# Altium schematic sheet Power Management.SchDoc
size A3; DrawnBy: UGUR KELES; SheetNumber: 2; SheetTotal: 3; Size: A3
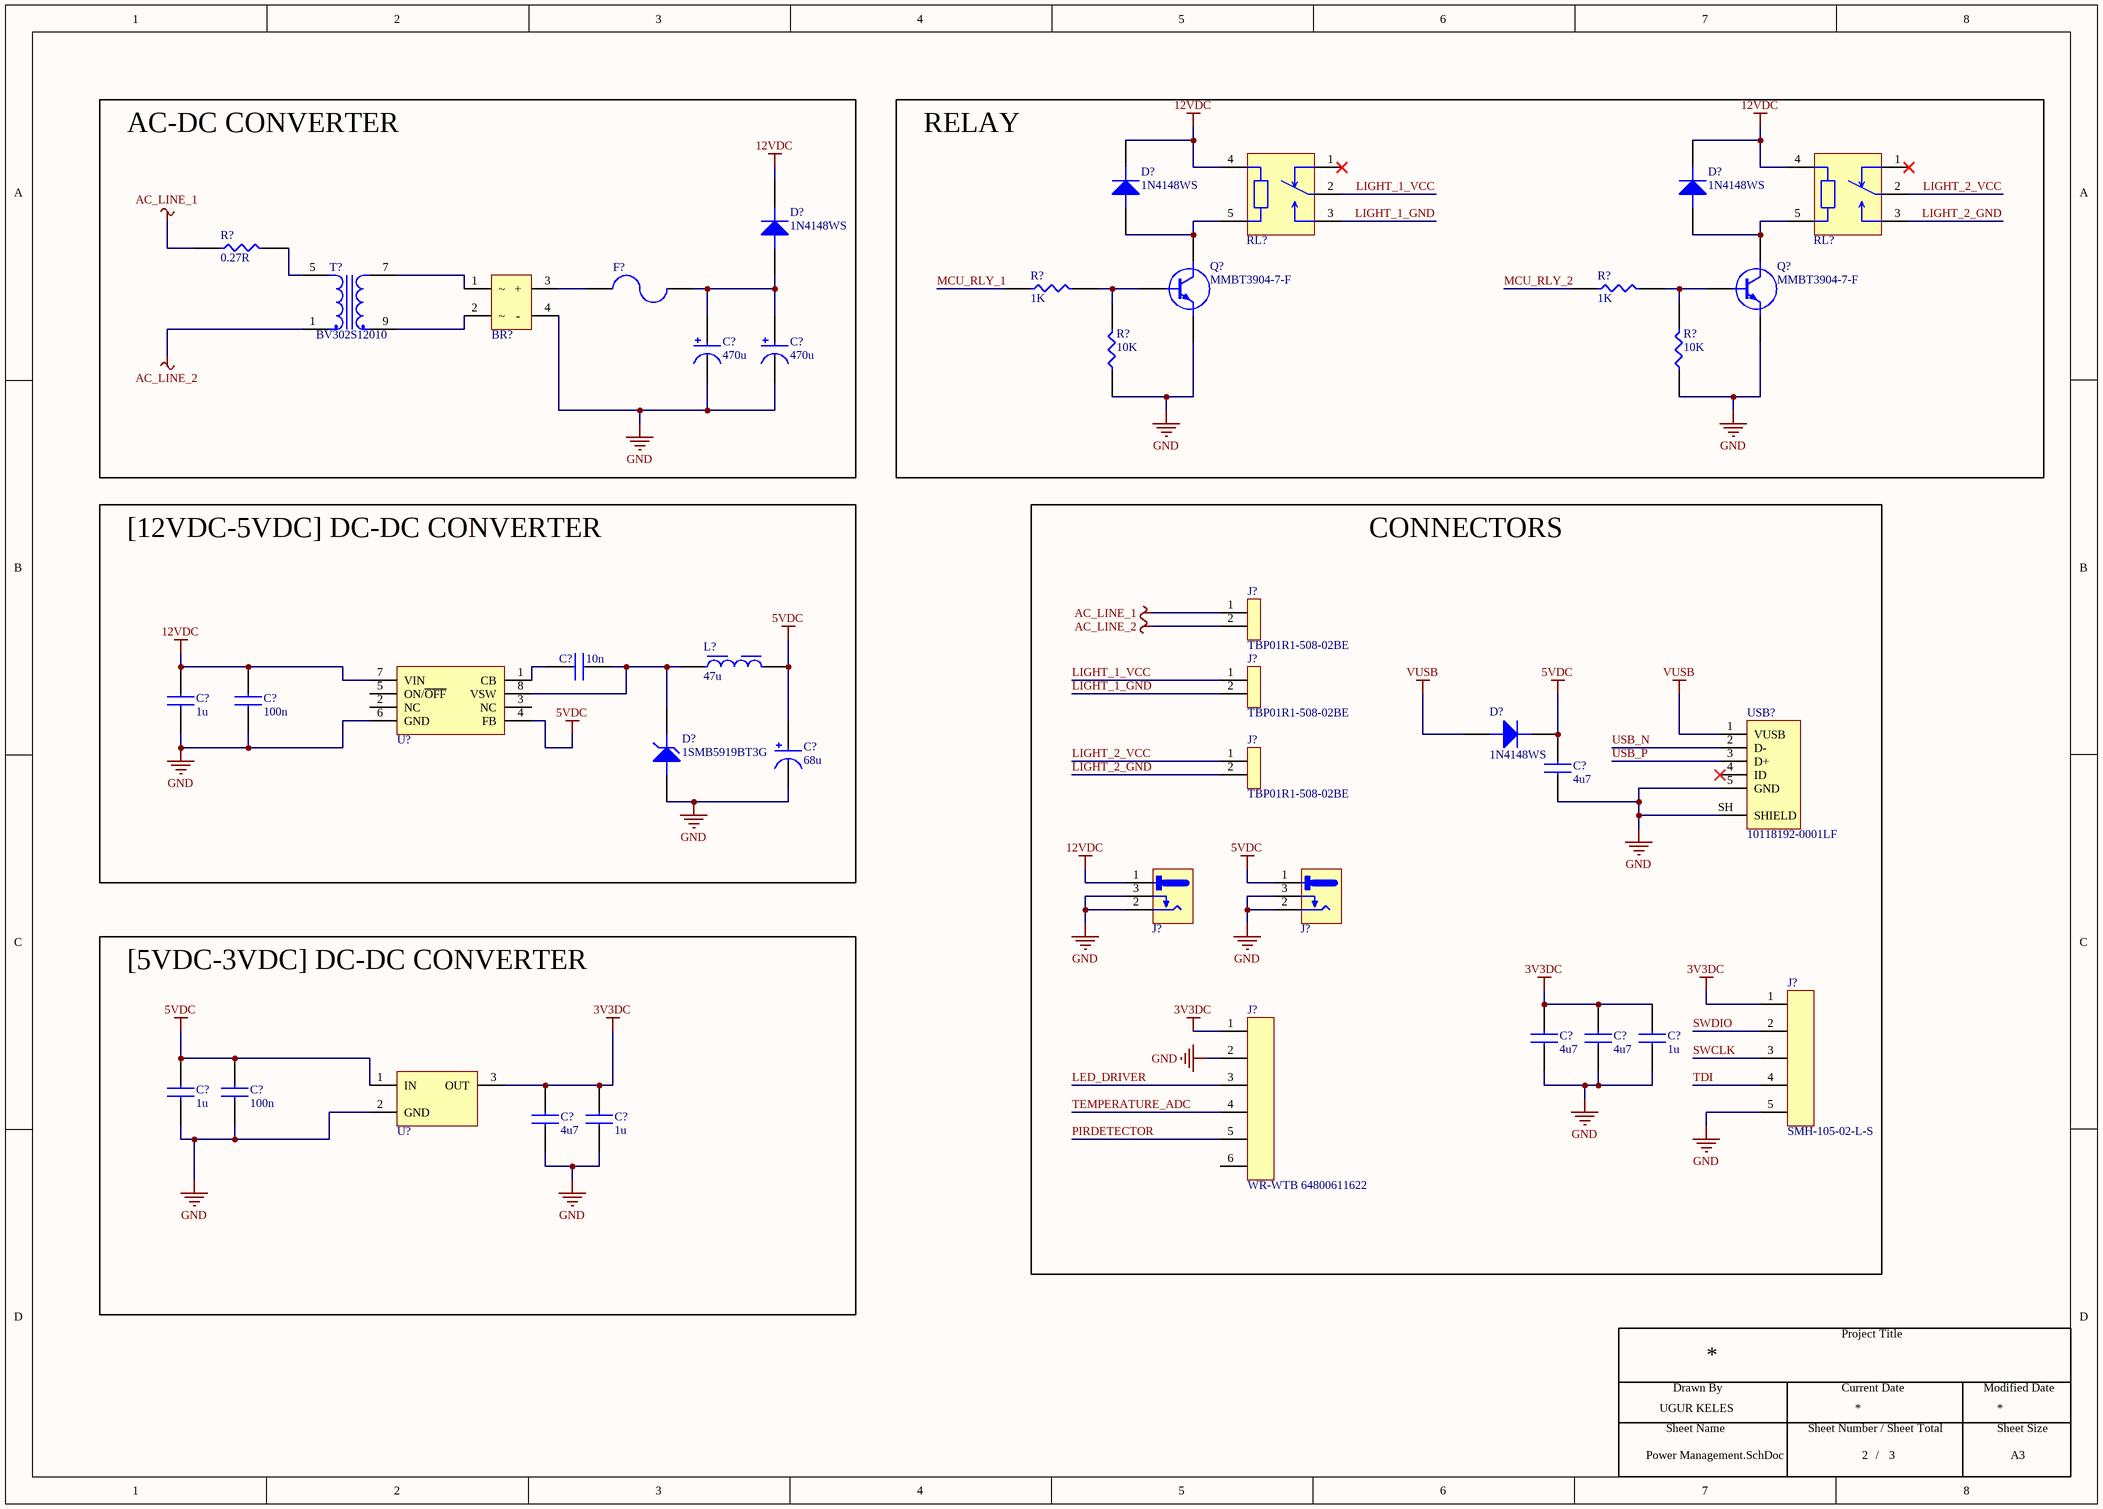
[diagram p0: Power Management.SchDoc]

## Parts
(Parts that share a designator on the sheet are numbered #1, #2 ... from top to bottom, then left to right.)
BR?  DB105S  [DB105S]  (value not drawn)
C?#1  470u  [CAP ALUM RADIAL TH D10 L20 P5]
C?#2  470u  [CAP ALUM RADIAL TH D10 L20 P5]
C?#3  10n  [CAPACITOR 0603]
C?#4  1u  [CAPACITOR 0805 - duplicate]
C?#5  100n  [CAPACITOR 0805 - duplicate]
C?#6  68u  [CAP ALUM RADIAL SMD D6.3 L7.7 P1.8]
C?#7  4u7  [CAPACITOR 0805 - duplicate]
C?#8  4u7  [CAPACITOR 0805 - duplicate]
C?#9  4u7  [CAPACITOR 0805 - duplicate]
C?#10  1u  [CAPACITOR 0805 - duplicate]
C?#11  1u  [CAPACITOR 0805 - duplicate]
C?#12  100n  [Capacitor 0603]
C?#13  4u7  [CAPACITOR 0805 - duplicate]
C?#14  1u  [CAPACITOR 0805 - duplicate]
D?#1  1N4148WS  [SOD-323F]
D?#2  1N4148WS  [SOD-323F]
D?#3  1N4148WS  [SOD-323F]
D?#4  1N4148WS  [SOD-323F]
D?#5  1SMB5919BT3G  [SMB]
F?  3413.0216.22  [3413.0216.22]  (value not drawn)
J?#1  TBP01R1-508-02BE  [2P TH TERMINAL 5.08 MALE]
J?#2  TBP01R1-508-02BE  [2P TH TERMINAL 5.08 MALE]
J?#3  TBP01R1-508-02BE  [2P TH TERMINAL 5.08 MALE]
J?#4  PJ-037AH-SMT-TR  [JACK]  (value not drawn)
J?#5  PJ-037AH-SMT-TR  [JACK]  (value not drawn)
J?#6  SMH-105-02-L-S  [5P TH CONN 2.54 FEMALE HEADER]
J?#7  WR-WTB 64800611622  [6P SMD TERMINAL 1.50 MALE]
L?  47u  [IND 1212]
Q?#1  MMBT3904-7-F  [SOT-23F]
Q?#2  MMBT3904-7-F  [SOT-23F]
R?#1  0.27R  [RES 5WD27 AXIAL]
R?#2  1K  [Resistor 0603]
R?#3  1K  [Resistor 0603]
R?#4  10K  [Resistor 0603]
R?#5  10K  [Resistor 0603]
RL?#1  ALQ112  [ALQ112]  (value not drawn)
RL?#2  ALQ112  [ALQ112]  (value not drawn)
T?  BV302S12010  [BV302S12010]
U?#1  LM2675MX-12/NOPB  [SOIC-8]  (value not drawn)
U?#2  AP7361-33E-13  [SOT223/SOT223R]  (value not drawn)
USB?  10118192-0001LF  [USB2.0 MICRO B SMD]

## Blocks framed on the sheet
AC-DC CONVERTER: BR? C?#1 C?#2 D?#3 F? R?#1 T?
RELAY: D?#1 D?#2 Q?#1 Q?#2 R?#2-R?#5 RL?#1 RL?#2
[12VDC-5VDC] DC-DC CONVERTER: C?#3-C?#6 D?#5 L? U?#1
CONNECTORS: C?#7-C?#10 D?#4 J?#1-J?#7 USB?
[5VDC-3VDC] DC-DC CONVERTER: C?#11-C?#14 U?#2

## Nets
3V3DC: C?#8.2 C?#9.2 C?#10.2 C?#13.2 C?#14.2 J?#6.1 J?#7.1 U?#2.3(OUT)
5VDC: C?#6.1 C?#7.2 C?#11.2 C?#12.2 D?#4.2(C) J?#5.1(VCC) L?.2 U?#1.4(FB) U?#2.1(IN)
12VDC: C?#4.2 C?#5.2 D?#1.2(C) D?#2.2(C) D?#3.2(C) J?#4.1(VCC) RL?#1.4 RL?#2.4 U?#1.7(VIN)
AC_LINE_1: J?#1.1 R?#1.1
AC_LINE_2: J?#1.2 T?.1
GND: BR?.4(-) C?#1.2 C?#2.2 C?#4.1 C?#5.1 C?#6.2 C?#7.1 C?#8.1 C?#9.1 C?#10.1 C?#11.1 C?#12.1 C?#13.1 C?#14.1 D?#5.1(A) J?#4.2(GND) J?#4.3(SH) J?#5.2(GND) J?#5.3(SH) J?#6.5 J?#7.2 Q?#1.2(E) Q?#2.2(E) R?#4.1 R?#5.1 U?#1.6(GND) U?#2.2(GND) USB?.5(GND) USB?.SH(SHIELD)
VUSB: D?#4.1(A) USB?.1(VUSB)
LED_DRIVER: J?#7.3
LIGHT_1_GND: J?#2.2 RL?#1.3
LIGHT_1_VCC: J?#2.1 RL?#1.2
LIGHT_2_GND: J?#3.2 RL?#2.3
LIGHT_2_VCC: J?#3.1 RL?#2.2
MCU_RLY_1: R?#2.1
MCU_RLY_2: R?#3.1
PIRDETECTOR: J?#7.5
SWCLK: J?#6.3
SWDIO: J?#6.2
TDI: J?#6.4
TEMPERATURE_ADC: J?#7.4
USB_N: USB?.2(D-)
USB_P: USB?.3(D+)
NetBR?_1: BR?.1 T?.7
NetBR?_2: BR?.2 T?.9
NetBR?_3: BR?.3(+) F?.1
NetC?#1_1: C?#1.1 C?#2.1 D?#3.1(A) F?.2
NetC?#3_1: C?#3.1 U?#1.1(CB)
NetC?#3_2: C?#3.2 D?#5.2(C) L?.1 U?#1.8(VSW)
NetD?#1_1: D?#1.1(A) Q?#1.3(C) RL?#1.5
NetD?#2_1: D?#2.1(A) Q?#2.3(C) RL?#2.5
NetQ?#1_1: Q?#1.1(B) R?#2.2 R?#4.2
NetQ?#2_1: Q?#2.1(B) R?#3.2 R?#5.2
NetR?#1_2: R?#1.2 T?.5

Not connected (* = marked no-connect by the designer): J?#7 6; RL?#1 1*; RL?#2 1*; U?#1 2(NC) 3(NC) 5(ON/~{OFF}); USB? 4(ID)*

## Notes on the sheet
- Drawn By
- Project Title
- Current Date
- Modified Date
- Sheet Name
- Sheet Number / Sheet Total
- /
- Sheet Size

## Library data of the parts
BR? = DB105S: Bridge Rectifier Single Phase Standard 600 V Surface Mount DB-S; Manufacturer: Sangdest Microelectronics; Designed by: UK; Supplier: Digikey; Supplier Part Number: 1655-DB105SCT-ND; Manufacturer Part Number: DB105S; RoHS: No; Category: Uncategorized; Stock: 12377; Pricing: 1=0.41, 10=0.29, 100=0.1464, 500=0.12978 (USD)
C?#1 C?#2 = CAP ALUM 470uF RADIAL TH: Radial Electrolytic Aluminium Capacitor, 470uF, 50VDC, 20%; Manufacturer: KEMET; Manufacturer Part Number: ESH477M050AH4AA; Designed by: UK; Voltage Rating (DC): 50V; Supplier: Digikey; Supplier Part Number: 399-15683-ND; RoHS: Yes; Category: LDO; Stock: 10333; Pricing: 1=0.64, 10=0.432, 200=0.28415, 1000=0.1887, 5000=0.1665, 10000=0.1554 (USD); Diameter: 10mm; Height: 20mm; ComponentLink1URL: https://api.kemet.com/component-edge/download/datasheet/ESH477M050AH4AA.pdf?src-supplier=Digikey; ComponentLink1Description: https://api.kemet.com/component-edge/download/datasheet/ESH477M050AH4AA.pdf?src-supplier=Digikey; ComponentLink2URL: https://datasheet.octopart.com/ESH477M050AH4AA-KEMET-datasheet-130075338.pdf?src-supplier=Newark; ComponentLink2Description: https://datasheet.octopart.com/ESH477M050AH4AA-KEMET-datasheet-130075338.pdf?src-supplier=Newark
C?#3 = CAP CER 10nF 0603: 0603 16V X7R 10nF 10% multilayer ceramic capacitor; Manufacturer: Walsin Technologies; Manufacturer Part Number: 0603B103K160CT; Designed by: UK; Supplier: Digikey; Supplier Part Number: 1292-1384-6-ND; RoHS: Yes; Category: Ceramic Capacitors; Stock: 66398; Pricing: 1=0.1, 10=0.031, 50=0.018, 100=0.0139, 500=0.0105, 1000=0.00825 (USD); Lead Free: 5697LeadFree; ComponentLink1URL: http://www.farnell.com/datasheets/1958513.pdf?src-supplier=Farnell; ComponentLink1Description: http://www.farnell.com/datasheets/1958513.pdf?src-supplier=Farnell; ComponentLink2URL: https://datasheet.octopart.com/0603B103K160CT-Walsin-Technologies-datasheet-136037192.pdf?src-supplier=Future+Electronics; ComponentLink2Description: https://datasheet.octopart.com/0603B103K160CT-Walsin-Technologies-datasheet-136037192.pdf?src-supplier=Future+Electronics; ComponentLink3URL: http://www.passivecomponent.com/wp-content/uploads/2018/10/MLCC.pdf?src-supplier=Digikey; ComponentLink3Description: http://www.passivecomponent.com/wp-content/uploads/2018/10/MLCC.pdf?src-supplier=Digikey; ComponentLink4URL: https://datasheet.octopart.com/0603B103K160CT-Walsin-Technologies-datasheet-85392065.pdf?src-supplier=Element14; ComponentLink4Description: https://datasheet.octopart.com/0603B103K160CT-Walsin-Technologies-datasheet-85392065.pdf?src-supplier=Element14; ComponentLink5URL: https://datasheet.octopart.com/0603B103K160CT-Walsin-Technologies-datasheet-62066062.pdf?src-supplier=TME; ComponentLink5Description: https://datasheet.octopart.com/0603B103K160CT-Walsin-Technologies-datasheet-62066062.pdf?src-supplier=TME
C?#4 C?#10 C?#11 C?#14 = CAP CER 1uF 0805: Multilayer Ceramic Capacitor, 1 uF, 50 V, ± 10%, X7R, 0805 [2012 Metric]; Manufacturer: Samsung; Manufacturer Part Number: CL21B105KBFNNNE; Designed by: UK; Voltage Rating (DC): 50V; Value: 1uF; Supplier: Digikey; Supplier Part Number: 1276-1029-2-ND; RoHS: Yes; Category: Ceramic Capacitors; Stock: 1265790; Pricing: 2000=0.02015, 4000=0.01844, 10000=0.01715, 14000=0.01629, 50000=0.01415, 100000=0.01169, 200000=0.0114 (USD); Mounting Technology: Surface Mount; Case/Package: 0805; Material: Ceramic; Case Code (Metric): 2012; Case Code (Imperial): 0805; Min Operating Temperature: -55°C; Max Operating Temperature: 125°C; Tolerance: 10%; Packaging: Tape and Reel; Package Quantity: 1; Voltage Rating: 50V; Dielectric: X7R; Voltage: 50V; Series: CL; Construction: Flat; Length: 2mm; Width: 0.049inch; Height: 1.25mm; Thickness: 0.053inch; Depth: 1.25mm; Radiation Hardening: No; RoHS Compliant: Yes; ComponentLink1URL: https://datasheet.ciiva.com/25800/cl21b105kbfnnne-25800291.pdf?src-supplier=Digikey; ComponentLink1Description: https://datasheet.ciiva.com/25800/cl21b105kbfnnne-25800291.pdf?src-supplier=Digikey
C?#5 = CAP CER 100nF 0805: Multilayer Ceramic Capacitor, 0.1 uF, 50 V, ± 10%, X7R, 0805 [2012 Metric]; Manufacturer: Samsung; Manufacturer Part Number: CL21B104KBCNNNC; Value: 100nF; Voltage Rating: 50V; Designed by: UK; Supplier: Digikey; Supplier Part Number: 1276-1003-6-ND; RoHS: Yes; Category: Ceramic Capacitors; Stock: 1751530; Pricing: 1=0.1, 10=0.042, 50=0.024, 100=0.0186, 500=0.01404, 1000=0.01103 (USD); Mounting Technology: Surface Mount; Case/Package: 0805; Case Code (Metric): 2012; Case Code (Imperial): 0805; Material: Ceramic; Min Operating Temperature: -55°C; Max Operating Temperature: 125°C; Tolerance: 10%; Dielectric: X7R; Packaging: Tape and Reel; Voltage: 50V; Series: CL; Construction: Flat; Voltage Rating (DC): 50V; Length: 2mm; Width: 0.049inch; Height: 0.85mm; Depth: 1.25mm; Thickness: 0.037inch; Radiation Hardening: No; RoHS Compliant: Yes; Lead Free: 5697LeadFree; ComponentLink1URL: https://datasheet.ciiva.com/25710/cl21b104kbcnnnc-25710182.pdf?src-supplier=Digikey; ComponentLink1Description: https://datasheet.ciiva.com/25710/cl21b104kbcnnnc-25710182.pdf?src-supplier=Digikey; ComponentLink2URL: https://datasheet.ciiva.com/29199/454152-da-01-en-vs-kondensator-0805-29199814.pdf?src-supplier=Conrad; ComponentLink2Description: https://datasheet.ciiva.com/29199/454152-da-01-en-vs-kondensator-0805-29199814.pdf?src-supplier=Conrad
C?#6 = CAP ALUM 68UF RADIAL SMD: Cap Aluminum Lytic 68uF 35V 20%( 6.3 X 7.7mm) SMD 0.34 Ohm 280mA 2000h 105C T/R; Manufacturer: KEMET; Manufacturer Part Number: EEV686M035A9HAA; Designed by: UK; Supplier: Mouser; Supplier Part Number: 80-EEV686M035A9HAA; RoHS: Yes; Category: Aluminum Electrolytic Capacitors; Stock: 13222; Pricing: 1=0.39, 10=0.221, 50=0.221, 100=0.143, 1000=0.125, 10000=0.125 (USD); ComponentLink1URL: https://datasheet.ciiva.com/5365/kem-a4002-eev-535332-5365784.pdf?src-supplier=Mouser; ComponentLink1Description: https://datasheet.ciiva.com/5365/kem-a4002-eev-535332-5365784.pdf?src-supplier=Mouser
C?#7-C?#9 C?#13 = CAP CER 4.7uF 0805: Multilayer Ceramic Capacitor, 4.7 uF, 25 V, ± 10%, X5R, 0805 [2012 Metric]; Manufacturer: Samsung; Manufacturer Part Number: CL21A475KAQNNNE; Designed by: UK; Value: 4.7uF; Voltage Rating: 25V; Supplier: Digikey; Supplier Part Number: 1276-1244-2-ND; RoHS: Yes; Category: Ceramic Capacitors; Stock: 3213374; Pricing: 2000=0.01305, 4000=0.01194, 10000=0.0111, 14000=0.01055, 50000=0.00978 (USD); Mounting Technology: Surface Mount; Case/Package: 0805; Case Code (Metric): 2012; Case Code (Imperial): 0805; Material: Ceramic; Min Operating Temperature: -55°C; Max Operating Temperature: 85°C; Packaging: Tape and Reel; Tolerance: 10%; Dielectric: X5R; Voltage Rating (DC): 25V; Series: CL; Construction: Flat; Length: 2mm; Height: 1.25mm; Depth: 1.25mm; Radiation Hardening: No; Lead Free: Lead Free; RoHS Compliant: Yes; ComponentLink1URL: https://datasheet.ciiva.com/25798/cl21a475kaqnnne-25798882.pdf?src-supplier=Digikey; ComponentLink1Description: https://datasheet.ciiva.com/25798/cl21a475kaqnnne-25798882.pdf?src-supplier=Digikey
C?#12 = CAP CER 100nF 0603: Multilayer Ceramic Capacitor, 0.1 uF, 50 V, ± 10%, X7R, 0603 [1608 Metric]; Manufacturer: KEMET; Manufacturer Part Number: C0603C104K5RACTU; Material: 4241ConductorMaterial; Value: 100nF; Voltage Rating: 50V; Temperature Coefficient: 30ppm/°C; Designed by: UK; Supplier: Digikey; Supplier Part Number: 399-C0603C104K5RAC7867TR-ND; RoHS: Yes; Category: Ceramic Capacitors; Stock: 3063153; Pricing: 4000=0.01394, 8000=0.01273, 12000=0.01212, 28000=0.01151, 100000=0.00833, 200000=0.00806, 400000=0.00758 (USD); Mounting Technology: Surface Mount; Case/Package: 0603; Min Operating Temperature: -55°C; Max Operating Temperature: 125°C; Tolerance: 10%; Dielectric: X7R; Packaging: Tape and Reel; Voltage: 50V; Series: SMD Comm X7R; Length: 0.063inch; Width: 0.031inch; Thickness: 0.034inch; RoHS Compliant: Yes; Lead Free: 5697LeadFree
D?#1-D?#4 = 1N4148WS: Diode Ultra Fast Recovery Rectifier 75V 0.15A 2-Pin SOD-323F T/R; Manufacturer: ON Semiconductor / Fairchild; Designed by: UK; Max Reverse Current: 5uA; Max Forward Surge Current (Ifsm): 2A; Value: 4pF; Forward Current: 150mA; Reverse Recovery Time: 4ns; Element Configuration: Single; Supplier: Digikey; Supplier Part Number: 1N4148WSFSDKR-ND; Manufacturer Part Number: 1N4148WS; RoHS: Yes; Category: Rectifier Diodes; Stock: 620002; Pricing: 1=0.19, 10=0.136, 100=0.0733, 500=0.0576, 1000=0.04 (USD); Mounting Technology: Surface Mount; Pins: 2; Weight: 0.0276g; Min Operating Temperature: -55°C; Max Operating Temperature: 150°C; Reverse Voltage: 75V; Average Rectified Current: 150mA; Max Repetitive Reverse Voltage (Vrrm): 75V; Max Reverse Voltage (DC): 75V; Series: -; Packaging: Tape and Reel; Package Quantity: 1; Recovery Time: 4ns; Length: 1.8mm; Width: 1.35mm; Height: 1mm; Radiation Hardening: No; RoHS Compliant: Yes; Lead Free: Lead Free; Reach SVHC Compliant: No
D?#5 = 1SMB5919BT3G: Diode Zener Single 5.6V 5% 550mW Automotive 2-Pin SMB T/R; Manufacturer: ON Semiconductor; Designed by: UK; Material: 4239ConductorMaterial; Breakdown Voltage: 5.88V; Power Rating: 3W; Supplier: Digikey; Supplier Part Number: 1SMB5919BT3GOSCT-ND; Manufacturer Part Number: 1SMB5919BT3G; RoHS: Yes; Category: Zener Diodes; Stock: 17150; Pricing: 1=0.48, 10=0.341, 100=0.1722, 500=0.15262, 1000=0.11878 (USD); Voltage Rating (DC): 5.6V; Lead Free: 5697LeadFree; Halogen Free: 5694HalogenFree; ComponentLink1URL: https://datasheet.ciiva.com/27747/1308331-27747654.pdf?src-supplier=Jameco; ComponentLink1Description: https://datasheet.ciiva.com/27747/1308331-27747654.pdf?src-supplier=Jameco; ComponentLink2URL: https://datasheet.ciiva.com/1182/1smb5913bt3-d-1182657.pdf?src-supplier=Element14; ComponentLink2Description: https://datasheet.ciiva.com/1182/1smb5913bt3-d-1182657.pdf?src-supplier=Element14; ComponentLink3URL: https://datasheet.ciiva.com/1182/1smb5913bt3-d-1182658.pdf?src-supplier=Element14; ComponentLink3Description: https://datasheet.ciiva.com/1182/1smb5913bt3-d-1182658.pdf?src-supplier=Element14; ComponentLink4URL: https://datasheet.ciiva.com/895/1smb5913bt3-d-895203.pdf?src-supplier=Digikey; ComponentLink4Description: https://datasheet.ciiva.com/895/1smb5913bt3-d-895203.pdf?src-supplier=Digikey; ComponentLink5URL: https://datasheet.ciiva.com/895/1smb5913bt3-d-895204.pdf?src-supplier=Digikey; ComponentLink5Description: https://datasheet.ciiva.com/895/1smb5913bt3-d-895204.pdf?src-supplier=Digikey; ComponentLink6URL: https://datasheet.ciiva.com/895/1smb5913bt3-d-895205.pdf?src-supplier=Digikey; ComponentLink6Description: https://datasheet.ciiva.com/895/1smb5913bt3-d-895205.pdf?src-supplier=Digikey; ComponentLink7URL: https://datasheet.ciiva.com/15198/getdatasheetpartid-311040-15198695.pdf?src-supplier=Verical; ComponentLink7Description: https://datasheet.ciiva.com/15198/getdatasheetpartid-311040-15198695.pdf?src-supplier=Verical; ComponentLink8URL: https://datasheet.ciiva.com/16311/1smb5913bt3-d-16311847.pdf?src-supplier=Future+Electronics; ComponentLink8Description: https://datasheet.ciiva.com/16311/1smb5913bt3-d-16311847.pdf?src-supplier=Future+Electronics
F? = 3413.0216.22: Fuse Chip Fast Acting 1A 32V SMD Solder Pad 1206 Glass T/R VDE/cULus; Manufacturer: Schurter; Designed by: UK; Body Material: Glass,Epoxy; Voltage Rating (DC): 63V; DC Cold Resistance: 94.2mR; Fuse Type: Board Mount (Cartridge Style Excluded); Approvals: VDE,cURus; Supplier: Digikey; Supplier Part Number: 486-1144-6-ND; Manufacturer Part Number: 3413.0216.22; RoHS: Yes; Category: Fuses; Stock: 16695; Pricing: 1=0.67, 50=0.524, 100=0.397, 500=0.345 (USD); Mounting Technology: Surface Mount,PCB; Case/Package: 1206; Pins: 2; Weight: 0.000212oz; Case Code (Metric): 3216; Case Code (Imperial): 1206; Contact Plating: Gold; Terminal Material: Tin; Min Operating Temperature: -55°C; Max Operating Temperature: 90°C; Current Rating: 1A; Package Quantity: 1000; Voltage Rating (AC): 32V; Packaging: Tape and Reel; Voltage Rating: 32V; Termination: SMD/SMT; Working Voltage: 32V; Series: USI 1206; Length: 3.2mm; Width: 1.6mm; Height: 0.6mm; Lead Free: Lead Free; RoHS Compliant: Yes; ComponentLink1URL: https://datasheet.ciiva.com/301/typ-usi-1206-301440.pdf?src-supplier=Digikey; ComponentLink1Description: https://datasheet.ciiva.com/301/typ-usi-1206-301440.pdf?src-supplier=Digikey; ComponentLink2URL: https://datasheet.ciiva.com/8264/typ-usi-1206-8264583.pdf?src-supplier=Avnet; ComponentLink2Description: https://datasheet.ciiva.com/8264/typ-usi-1206-8264583.pdf?src-supplier=Avnet; ComponentLink3URL: https://datasheet.ciiva.com/16316/typ-usi-1206-16316588.pdf?src-supplier=Future+Electronics; ComponentLink3Description: https://datasheet.ciiva.com/16316/typ-usi-1206-16316588.pdf?src-supplier=Future+Electronics; ComponentLink4URL: https://datasheet.ciiva.com/301/typ-usi-1206-301439.pdf?src-supplier=Digikey; ComponentLink4Description: https://datasheet.ciiva.com/301/typ-usi-1206-301439.pdf?src-supplier=Digikey; ComponentLink5URL: https://datasheet.ciiva.com/14541/70160006-14541114.pdf?src-supplier=Allied+Electronics; ComponentLink5Description: https://datasheet.ciiva.com/14541/70160006-14541114.pdf?src-supplier=Allied+Electronics; ComponentLink6URL: https://datasheet.ciiva.com/14102/qousi1206-data-e-14102903.pdf?src-supplier=Distrelec; ComponentLink6Description: https://datasheet.ciiva.com/14102/qousi1206-data-e-14102903.pdf?src-supplier=Distrelec; ComponentLink7URL: https://datasheet.ciiva.com/301/typ-usi-1206-301441.pdf?src-supplier=Digikey; ComponentLink7Description: https://datasheet.ciiva.com/301/typ-usi-1206-301441.pdf?src-supplier=Digikey
J?#1-J?#3 = 2P TH TERMINAL 5.08 MALE: 2 Poles, Pluggable, Receptacle, Horizontal, 5.08 Pitch, Terminal Block Connector; Manufacturer: CUI Devices; Designed by: UK; Supplier: Digikey; Supplier Part Number: 102-6406-ND; Manufacturer Part Number: TBP01R1-508-02BE; RoHS: Yes; Category: Terminal Blocks; Stock: 98988; Pricing: 1=0.33, 10=0.176, 25=0.1244, 50=0.1058, 100=0.1022, 400=0.08638, 800=0.0743, 1200=0.07058, 5200=0.0654 (USD); ComponentLink1URL: https://www.cuidevices.com/product/resource/digikeypdf/tbp01r1-508.pdf?src-supplier=Digikey; ComponentLink1Description: https://www.cuidevices.com/product/resource/digikeypdf/tbp01r1-508.pdf?src-supplier=Digikey; ComponentLink2URL: https://datasheet.octopart.com/TBP01R1-508-02BE-CUI-Devices-datasheet-147843976.pdf?src-supplier=Future+Electronics; ComponentLink2Description: https://datasheet.octopart.com/TBP01R1-508-02BE-CUI-Devices-datasheet-147843976.pdf?src-supplier=Future+Electronics; ComponentLink3URL: https://datasheet.octopart.com/TBP01R1-508-02BE-CUI-Devices-datasheet-154730754.pdf?src-supplier=Electro+Sonic; ComponentLink3Description: https://datasheet.octopart.com/TBP01R1-508-02BE-CUI-Devices-datasheet-154730754.pdf?src-supplier=Electro+Sonic
J?#4 J?#5 = PJ-037AH-SMT-TR: 2.0 x 6.3 mm, 5.0 A, Horizontal, Surface Mount (SMT), Dc Power Jack Connector; Manufacturer: CUI; Designed by: UK; Number of Conductors: 2; Gender: Male; Shielding: Unshielded; Current Rating: 5A; Voltage Rating: 24V; Insulation Resistance: 100MR; Supplier: Digikey; Supplier Part Number: CP-037AHPJTR-ND; Manufacturer Part Number: PJ-037AH-SMT-TR; RoHS: Yes; Category: Uncategorized; Mounting Technology: Surface Mount,Through Hole; Case/Package: SMD/SMT; Color: Black; Contact Material: Copper; Contact Plating: Nickel; Housing Color: Black; Housing Material: Thermoplastic; Min Operating Temperature: -25°C; Max Operating Temperature: 85°C; Orientation: Horizontal; Package Quantity: 200; Termination: Solder; Connector Type: Jack; Contact Gender: Male; Packaging: Tape and Reel; Flammability Rating: UL94 V-0; ComponentLink1URL: http://www.mouser.com/ds/2/670/pj-037ah-smt-516065.pdf?src-supplier=Mouser; ComponentLink1Description: http://www.mouser.com/ds/2/670/pj-037ah-smt-516065.pdf?src-supplier=Mouser; ComponentLink2URL: https://www.cui.com/product/resource/digikeypdf/pj-037ah-smt-tr.pdf?src-supplier=Digikey; ComponentLink2Description: https://www.cui.com/product/resource/digikeypdf/pj-037ah-smt-tr.pdf?src-supplier=Digikey; ComponentLink3URL: http://www.cui.com/product/resource/digikeypdf/pj-037ah-smt.pdf?src-supplier=Digikey; ComponentLink3Description: http://www.cui.com/product/resource/digikeypdf/pj-037ah-smt.pdf?src-supplier=Digikey
J?#6 = 5P SMD CONN 2.54 FEMALE HEADER: PCB Receptacle, Board-to-Board, 2.54 mm, 1 Rows, 5 Contacts, Surface Mount, SMH; Manufacturer: Samtec; Designed by: UK; Number of Contacts: 5; Pitch: 2.54mm; Supplier: Digikey; Supplier Part Number: SAM11813-ND; Manufacturer Part Number: SMH-105-02-L-S; RoHS: Yes; Category: Connectors; Stock: 2; Pricing: 1=2.01, 50=1.56, 100=1.26, 500=1.07, 1000=1 (USD); Contact Plating: Gold; Contact Material: Bronze; Contact Finish - Mating: GOLD; Insulation Color: Black; Insulation Material: Polymer; Contact Shape: Square; Min Operating Temperature: -55°C; Max Operating Temperature: 125°C; Packaging: Rail/Tube; Number of Rows: 1; Termination: Solder; Gender: Receptacle; Orientation: Horizontal; Connector Type: Receptacle; Fastening Type: Pull; Series: SMH; Contact Type: Forked; Number of Positions: 5; Radiation Hardening: No; RoHS Compliant: Yes; Reach SVHC Compliant: No; Flammability Rating: UL94 V-0; ComponentLink1URL: http://www.farnell.com/datasheets/1927708.pdf?_ga=2.237598468.569325269.1503285096-1413671594.1503025027&src-supplier=Farnell; ComponentLink1Description: http://www.farnell.com/datasheets/1927708.pdf?_ga=2.237598468.569325269.1503285096-1413671594.1503025027&src-supplier=Farnell; ComponentLink2URL: http://www.samtec.com/documents/webfiles/pdf/SMH.PDF?src-supplier=Newark; ComponentLink2Description: http://www.samtec.com/documents/webfiles/pdf/SMH.PDF?src-supplier=Newark; ComponentLink3URL: http://www.samtec.com/documents/webfiles/pdf/SMH.PDF?src-supplier=Avnet; ComponentLink3Description: http://www.samtec.com/documents/webfiles/pdf/SMH.PDF?src-supplier=Avnet; ComponentLink4URL: http://suddendocs.samtec.com/catalog_english/smh.pdf?src-supplier=Digikey; ComponentLink4Description: http://suddendocs.samtec.com/catalog_english/smh.pdf?src-supplier=Digikey
J?#7 = 6P SMD TERMINAL 1.50 MALE: WR-WTB Wire-to-Board Connectors 1.50 mm; Manufacturer: Wurth Electronics; Designed by: UK; Supplier: Digikey; Supplier Part Number: 732-64800611622-ND; Manufacturer Part Number: 64800611622; RoHS: No; Category: Uncategorized; Stock: 1319; Pricing: 1=0.42, 50=0.406, 100=0.384, 250=0.361, 500=0.339 (USD)
L? = IND 47uH: Power Inductor, Aec-Q200, 47Uh, 0.39A Rohs Compliant: Yes |Wurth Elektronik 78438335470; Manufacturer: Wurth Electronics; Designed by: UK; Core Material: Ferrite; Current Rating: 390mA; Saturation Current: 1.18A; Shielding: Shielded; DC Resistance (DCR): 2.3R; Self Resonant Frequency: 8MHz; Test Frequency: 100kHz; Tolerance: 30%; Supplier: Digikey; Supplier Part Number: 732-6947-6-ND; Manufacturer Part Number: 78438335470; RoHS: Yes; Category: Fixed Inductors; Stock: 5684; Pricing: 1=2.11, 50=1.97, 250=1.803, 500=1.672 (USD); Mounting Technology: Surface Mount; Case/Package: 1212; Case Code (Metric): 3030; Case Code (Imperial): 1212; Min Operating Temperature: -40°C; Max Operating Temperature: 125°C; Packaging: Cut Tape; Value: 47uH; Series: WE-MAIA; Length: 0.118inch; Width: 0.118inch; Height - Seated (Max): 0.059inch; Ratings: AEC-Q200; RoHS Compliant: Yes; ComponentLink1URL: https://media.digikey.com/pdf/Data%20Sheets/Wurth%20Electronics%20PDFs/Q+_Products_Flyer.pdf?src-supplier=Digikey; ComponentLink1Description: https://media.digikey.com/pdf/Data%20Sheets/Wurth%20Electronics%20PDFs/Q+_Products_Flyer.pdf?src-supplier=Digikey
Q?#1 Q?#2 = MMBT3904-7-F: Transistor General Purpose BJT NPN 40 Volt 0.2A Automotive 3-Pin SOT-23; Manufacturer: Diodes Zetex; Designed by: UK; Max Power Dissipation: 300mW; Collector Emitter Voltage (VCEO): 40V; Max Collector Current: 200mA; Collector Base Voltage (VCBO): 60V; Power Dissipation: 350mW; Frequency: 300MHz; hFE Min: 100; Number of Elements: 1; Emitter Base Voltage (VEBO): 6V; Collector Emitter Saturation Voltage: 300mV; Supplier: Digikey; Supplier Part Number: MMBT3904-FDICT-ND; Manufacturer Part Number: MMBT3904-7-F; RoHS: Yes; Category: BJTs; Stock: 4408549; Pricing: 1=0.12, 10=0.086, 100=0.0467, 500=0.03666, 1000=0.02545 (USD); Mounting Technology: Surface Mount; Case/Package: SOT-23; Pins: 3; Weight: 0.000282oz; Min Operating Temperature: -55°C; Max Operating Temperature: 150°C; Polarity: NPN; Packaging: Tape and Reel; Voltage Rating (DC): 40V; Package Quantity: 3000; Transition Frequency: 300MHz; Collector Emitter Breakdown Voltage: 40V; Max Breakdown Voltage: 40V; Continuous Collector Current: 200mA; Clock Frequency: 300MHz; Gain Bandwidth Product: 300MHz; Series: Automotive, AEC-Q101; Collector-emitter Voltage-Max: 300mV; Length: 3.05mm; Width: 1.4mm; Height: 1mm; Radiation Hardening: No; Reach SVHC Compliant: No; Lead Free: Lead Free; RoHS Compliant: Yes; ComponentLink1URL: https://datasheet.ciiva.com/11201/ds30036-11201778.pdf?src-supplier=Avnet; ComponentLink1Description: https://datasheet.ciiva.com/11201/ds30036-11201778.pdf?src-supplier=Avnet; ComponentLink2URL: https://datasheet.ciiva.com/15138/getdatasheetpartid-53265-15138780.pdf?src-supplier=Verical; ComponentLink2Description: https://datasheet.ciiva.com/15138/getdatasheetpartid-53265-15138780.pdf?src-supplier=Verical; ComponentLink3URL: https://datasheet.ciiva.com/22711/1915516-22711750.pdf?src-supplier=Element14; ComponentLink3Description: https://datasheet.ciiva.com/22711/1915516-22711750.pdf?src-supplier=Element14; ComponentLink4URL: https://datasheet.ciiva.com/11198/ds30036-11198999.pdf?src-supplier=Avnet; ComponentLink4Description: https://datasheet.ciiva.com/11198/ds30036-11198999.pdf?src-supplier=Avnet; ComponentLink5URL: https://datasheet.ciiva.com/6361/ds30036-6361256.pdf?src-supplier=Digikey; ComponentLink5Description: https://datasheet.ciiva.com/6361/ds30036-6361256.pdf?src-supplier=Digikey; ComponentLink6URL: https://datasheet.ciiva.com/6361/ds30036-6361254.pdf?src-supplier=Digikey; ComponentLink6Description: https://datasheet.ciiva.com/6361/ds30036-6361254.pdf?src-supplier=Digikey
R?#1 = RES 0.27R AXIAL: 270 mOhms ±5% 5W Through Hole Resistor Axial Wirewound; Designed by: UK; Temperature Coefficient: ±300ppm/°C; Resistance: 270 mOhms; Tolerance: ±5%; Power (Watts): 5W; Composition: Wirewound; Operating Temperature: -55°C ~ 155°C; Package / Case: Axial; Size / Dimension: 0.380" Square x 0.866" L (9.65mm x 22.00mm); ComponentLink1Description: Datasheet; ComponentLink1URL: https://www.nteinc.com/resistor_web/pdf/fivewire.pdf
R?#2 R?#3 = RES 1K 0603: SMD Chip Resistor, 1 kOhm, ± 1%, 100 mW, 0603 [1608 Metric], Thick Film, General Purpose; Manufacturer: Yageo; Manufacturer Part Number: RC0603FR-071KL; Designed by: UK; Value: 1kR; Temperature Coefficient: 100ppm/°C; Power Rating: 100mW; Voltage Rating: 50V; Supplier: Digikey; Supplier Part Number: 311-1.00KHRCT-ND; RoHS: Yes; Category: Chip SMD Resistors; Stock: 12285830; Pricing: 1=0.1, 10=0.019, 50=0.0112, 100=0.0093, 500=0.00622, 1000=0.00532 (USD); Case/Package: 0603; Contact Plating: Tin,Matte; Case Code (Imperial): 0603; Case Code (Metric): 1608; Min Operating Temperature: -55°C; Max Operating Temperature: 155°C; Tolerance: 1%; Resistor Type: Thick Film; Packaging: Tape and Reel; Termination: SMD/SMT; Features: Moisture Resistant; Series: RC; Max Power Dissipation: 100mW; Number of Terminations: 2; Technology: THICK FILM; Resistance Tolerance: 1%; Construction: Rectangular; Length: 1.6mm; Height: 0.45mm; Depth: 0.8mm; Reach SVHC Compliant: No; Lead Free: 5697LeadFree; Military Standard: Not; RoHS Compliant: Yes
R?#4 R?#5 = RES 10K 0603: SMD Chip Resistor, 10 kOhm, ± 1%, 100 mW, 0603 [1608 Metric], Thick Film, General Purpose; Manufacturer: Yageo; Manufacturer Part Number: RC0603FR-0710KL; Value: 10kR; Power Rating: 100mW; Voltage Rating: 75V; Temperature Coefficient: 100ppm/°C; Voltage Rating (DC): 50V; Designed by: UK; Supplier: Digikey; Supplier Part Number: 311-10.0KHRTR-ND; RoHS: Yes; Category: Chip SMD Resistors; Stock: 11745000; Pricing: 5000=0.00382, 10000=0.00335, 25000=0.00287, 35000=0.00278, 50000=0.00257, 125000=0.00232 (USD); Case/Package: 0603; Pins: 2; Case Code (Imperial): 0603; Case Code (Metric): 1608; Weight: 7.1E-05oz; Min Operating Temperature: -55°C; Max Operating Temperature: 155°C; Tolerance: 1%; Series: RC; Packaging: Tape and Reel; Termination: SMD/SMT; Max Power Dissipation: 100mW; Resistor Type: Thick Film; Number of Terminations: 2; Resistance Tolerance: 1%; Features: Moisture Resistant; Construction: Rectangular; Length: 1.6mm; Width: 0.8mm; Height: 0.45mm; Depth: 0.8mm; Lead Pitch: 0.3mm; RoHS Compliant: Yes; Lead Free: 5697LeadFree; Reach SVHC Compliant: No; Military Standard: Not
RL?#1 RL?#2 = ALQ112: Electromechanical Relay 12VDC 360Ohm 10(NO)/3(NC)A SPDT (( 20mm 10mm 16mm)) THT Power Relay; Manufacturer: Panasonic; Designed by: UK; Supplier: Digikey; Supplier Part Number: 255-3562-ND; Manufacturer Part Number: ALQ112; RoHS: Yes; Category: Power Relays; Stock: 34740; Pricing: 1=1.28, 10=1.204, 25=1.0704, 50=1.017, 100=0.9635, 300=0.85647, 500=0.80296, 1000=0.74942, 5000=0.72266 (USD); ComponentLink1URL: https://datasheet.ciiva.com/24388/307ds-61b20-en-lq-24388909.pdf?src-supplier=Onlinecomponents.com; ComponentLink1Description: https://datasheet.ciiva.com/24388/307ds-61b20-en-lq-24388909.pdf?src-supplier=Onlinecomponents.com
T? = BV302S12010: Sealed Transformer EI30/10.5; Manufacturer: Zettler Magnetics; Designed by: UK; Supplier: Digikey; Supplier Part Number: 3388-BV302S12010-ND; Manufacturer Part Number: BV302S12010; RoHS: No; Category: Uncategorized; Stock: 541; Pricing: 1=2.97, 15=2.37533, 30=1.93, 60=1.88067, 105=1.83114, 255=1.78165, 510=1.76678, 1005=1.56388, 5010=1.43521 (USD); RoHS Compliant: No
U?#1 = LM2675MX-12/NOPB: Buck Switching Regulator IC Positive Fixed 12V 1 Output 1A 8-SOIC (0.154", 3.90mm Width); Manufacturer: TI National Semiconductor; Number of Outputs: 1; Efficiency: 94%; Min Input Voltage: 8V; Max Supply Voltage: 40V; Switching Frequency: 260kHz; Quiescent Current: 2.5mA; Designed by: UK; Supplier: Digikey; Supplier Part Number: 296-35410-1-ND; Manufacturer Part Number: LM2675MX-12/NOPB; RoHS: Yes; Category: Voltage Regulators - Switching; Stock: 3258; Pricing: 1=4.71, 10=4.231, 25=3.9996, 100=3.4663, 250=3.28856, 500=2.95082, 1000=2.48864 (USD); Mounting Technology: Surface Mount; Case/Package: SOIC N; Pins: 8; Min Operating Temperature: -40°C; Max Operating Temperature: 125°C; Output Voltage: 12V; Output Current: 1A; Packaging: Tape and Reel; Max Output current: 1A; Package Quantity: 2500; Operating Supply Voltage: 40V; Output Type: Fixed; Series: LM2675; Radiation Hardening: No; Lead Free: Lead Free; RoHS Compliant: Yes; ComponentLink1URL: https://datasheet.ciiva.com/41457/001013881-da-01-en-ic-reg-buck-lm2675mx-12-nopb-soic-8-tid-41457896.pdf?src-supplier=Conrad; ComponentLink1Description: https://datasheet.ciiva.com/41457/001013881-da-01-en-ic-reg-buck-lm2675mx-12-nopb-soic-8-tid-41457896.pdf?src-supplier=Conrad; ComponentLink2URL: https://datasheet.ciiva.com/3220/lm2675-3220840.pdf?src-supplier=Avnet; ComponentLink2Description: https://datasheet.ciiva.com/3220/lm2675-3220840.pdf?src-supplier=Avnet
U?#2 = AP7361-33E-13: Linear Voltage Regulator IC Positive Fixed 1 Output 1A SOT-223-3; Manufacturer: Diodes; Number of Outputs: 1; Min Input Voltage: 2.2V; Max Supply Voltage: 6V; Output Voltage: 3.3V; Max Power Dissipation: 1.1W; Dropout Voltage: 500mV; Min Current Limit: 1.1A; Quiescent Current: 70uA; Power Dissipation: 1.1kW; Accuracy: 1%; Power Supply Rejection Ratio (PSRR): 65dB; Reference Voltage: 800mV; Designed by: UK; Supplier: Digikey; Supplier Part Number: AP7361-33E-13DITR-ND; Manufacturer Part Number: AP7361-33E-13; RoHS: Yes; Category: Voltage Regulators - Linear; Stock: 115000; Pricing: 2500=0.14532, 5000=0.13651, 12500=0.1277, 25000=0.11714, 62500=0.11273 (USD); Mounting Technology: Surface Mount; Case/Package: SOT-223; Pins: 4; Weight: 0.000282oz; Contact Plating: Tin,Matte; Min Operating Temperature: -40°C; Max Operating Temperature: 85°C; Max Output current: 1A; Package Quantity: 1; Packaging: Tape and Reel; Output Current: 1A; Number of Regulators: 1; Polarity: Positive; Output Type: Fixed; Series: -; Radiation Hardening: No; Reach SVHC Compliant: Yes; Lead Free: Lead Free; RoHS Compliant: Yes; ComponentLink1URL: https://datasheet.ciiva.com/26926/getdatasheetpartid-670786-26926141.pdf?src-supplier=Verical; ComponentLink1Description: https://datasheet.ciiva.com/26926/getdatasheetpartid-670786-26926141.pdf?src-supplier=Verical; ComponentLink2URL: https://datasheet.ciiva.com/29568/ap7361-29568378.pdf?src-supplier=Digikey; ComponentLink2Description: https://datasheet.ciiva.com/29568/ap7361-29568378.pdf?src-supplier=Digikey
USB? = Micro B USB Connector: CONN USB MICRO B RECPT SMT R/A; Manufacturer: Amphenol ICC / FCI; Designed by: UK; Gender: Receptacle; Connector Type: USB,Receptacle; USB Standard: USB 2.0; Number of Contacts: 5; Current Rating: 1.8A; Insulation Resistance: 1GR; Number of Ports: 1; Max Voltage Rating (AC): 100V; Pitch: 0.65mm; Supplier: Digikey; Supplier Part Number: 609-4613-1-ND; Manufacturer Part Number: 10118192-0001LF; RoHS: No; Category: Uncategorized; Stock: 57642; Pricing: 1=0.46, 10=0.404, 25=0.3696, 50=0.3478, 100=0.3334, 250=0.30436, 500=0.28988 (USD); Mounting Technology: Surface Mount,Horizontal; Pins: 5; Color: Black; Contact Material: Copper Alloy; Contact Plating: Gold; Housing Material: Polymer; Min Operating Temperature: -55°C; Max Operating Temperature: 85°C; Orientation: Right Angle; Features: Shielded; Termination: Solder; Voltage Rating: 100V; Series: -; Packaging: Tape and Reel; Package Quantity: 1400; Length: 7.86mm; Depth: 5.57mm; Radiation Hardening: No; Flammability Rating: UL94 V-0; Reach SVHC Compliant: No